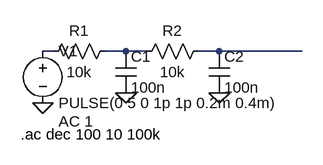
[diagram p0: schematic Moyenne.asc]
Moyenne.asc, the LTspice schematic file:
Version 4
SHEET 1 880 680
WIRE 0 128 -16 128
WIRE 112 128 80 128
WIRE 144 128 112 128
WIRE 256 128 224 128
WIRE 384 128 256 128
FLAG 112 192 0
FLAG 256 192 0
FLAG -16 208 0
SYMBOL res 96 112 R90
WINDOW 0 0 56 VBottom 2
WINDOW 3 32 56 VTop 2
SYMATTR InstName R1
SYMATTR Value 10k
SYMBOL res 240 112 R90
WINDOW 0 0 56 VBottom 2
WINDOW 3 32 56 VTop 2
SYMATTR InstName R2
SYMATTR Value 10k
SYMBOL cap 96 128 R0
SYMATTR InstName C1
SYMATTR Value 100n
SYMATTR SpiceLine V=4 Irms=0 Rser=0 Lser=0
SYMBOL cap 240 128 R0
SYMATTR InstName C2
SYMATTR Value 100n
SYMBOL voltage -16 112 R0
WINDOW 123 24 124 Left 2
WINDOW 39 0 0 Left 0
SYMATTR InstName V1
SYMATTR Value PULSE(0 5 0 1p 1p 0.2m 0.4m)
SYMATTR Value2 AC 1
TEXT -50 256 Left 2 !.ac dec 100 10 100k

The netlist it stands for:
* Moyenne.asc
R1 N002 N001 10k
R2 N003 N002 10k
C1 N002 0 100n V=4 Irms=0 Rser=0 Lser=0
C2 N003 0 100n
V1 N001 0 PULSE(0 5 0 1p 1p 0.2m 0.4m) AC 1
.ac dec 100 10 100k
.backanno
.end